# EAGLE design LCD board (EAGLE 9.1.3)
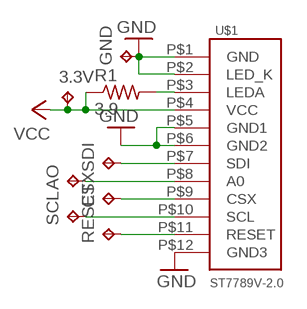
[diagram p0: schematic, sheet 1]

## Parts
3.3V  TPTP18RECT  [TP18RECT]
AO  TPTP18RECT  [TP18RECT]
CSX  TPTP18RECT  [TP18RECT]
GND  TPTP18RECT  [TP18RECT]
R1  3.9  R-US_R0603  [R0603]
RESET  TPTP18RECT  [TP18RECT]
SCL  TPTP18RECT  [TP18RECT]
SDI  TPTP18RECT  [TP18RECT]
U$1  ST7789V-2.0  [ST7789V-2.0]

## Nets
GND: GND.TP U$1.P$1(GND) U$1.P$2(LED_K) U$1.P$5(GND1) U$1.P$6(GND2) U$1.P$12(GND3)
N$1: R1.2 U$1.P$3(LEDA)
N$2: SDI.TP U$1.P$7(SDI)
N$3: AO.TP U$1.P$8(A0)
N$4: CSX.TP U$1.P$9(CSX)
N$5: SCL.TP U$1.P$10(SCL)
N$6: RESET.TP U$1.P$11(RESET)
VCC: 3.3V.TP R1.1 U$1.P$4(VCC)

## Library data of the parts
3.3V AO CSX GND RESET SCL SDI = testpad-old:TP: Test pad
R1 = resistor:R-US_: RESISTOR, American symbol
U$1 = ili9341:ST7789V-2.0

## Board
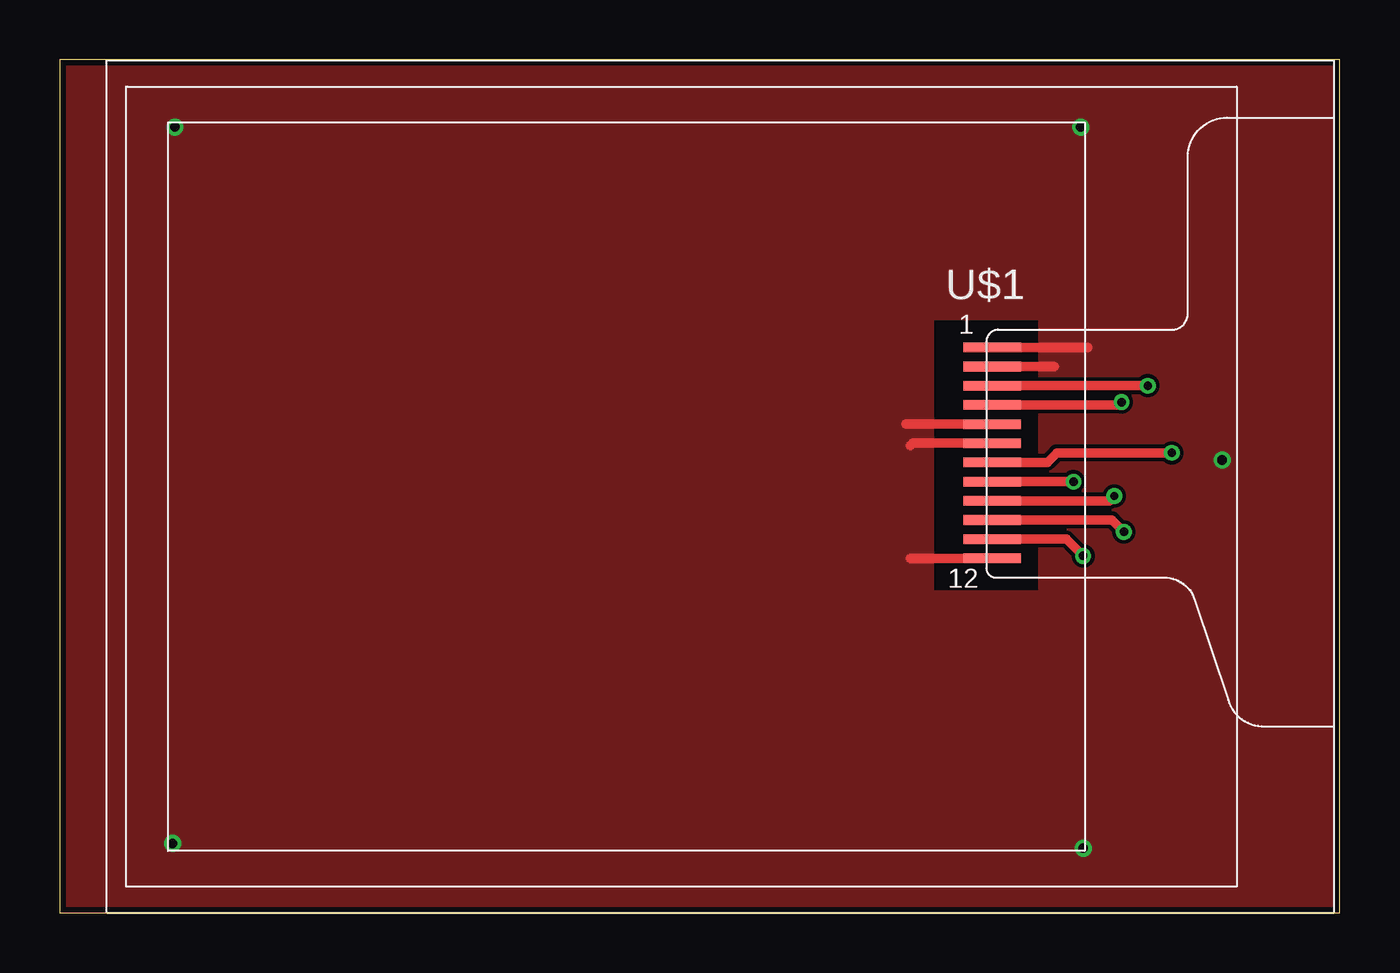
[diagram p1: board, top side]
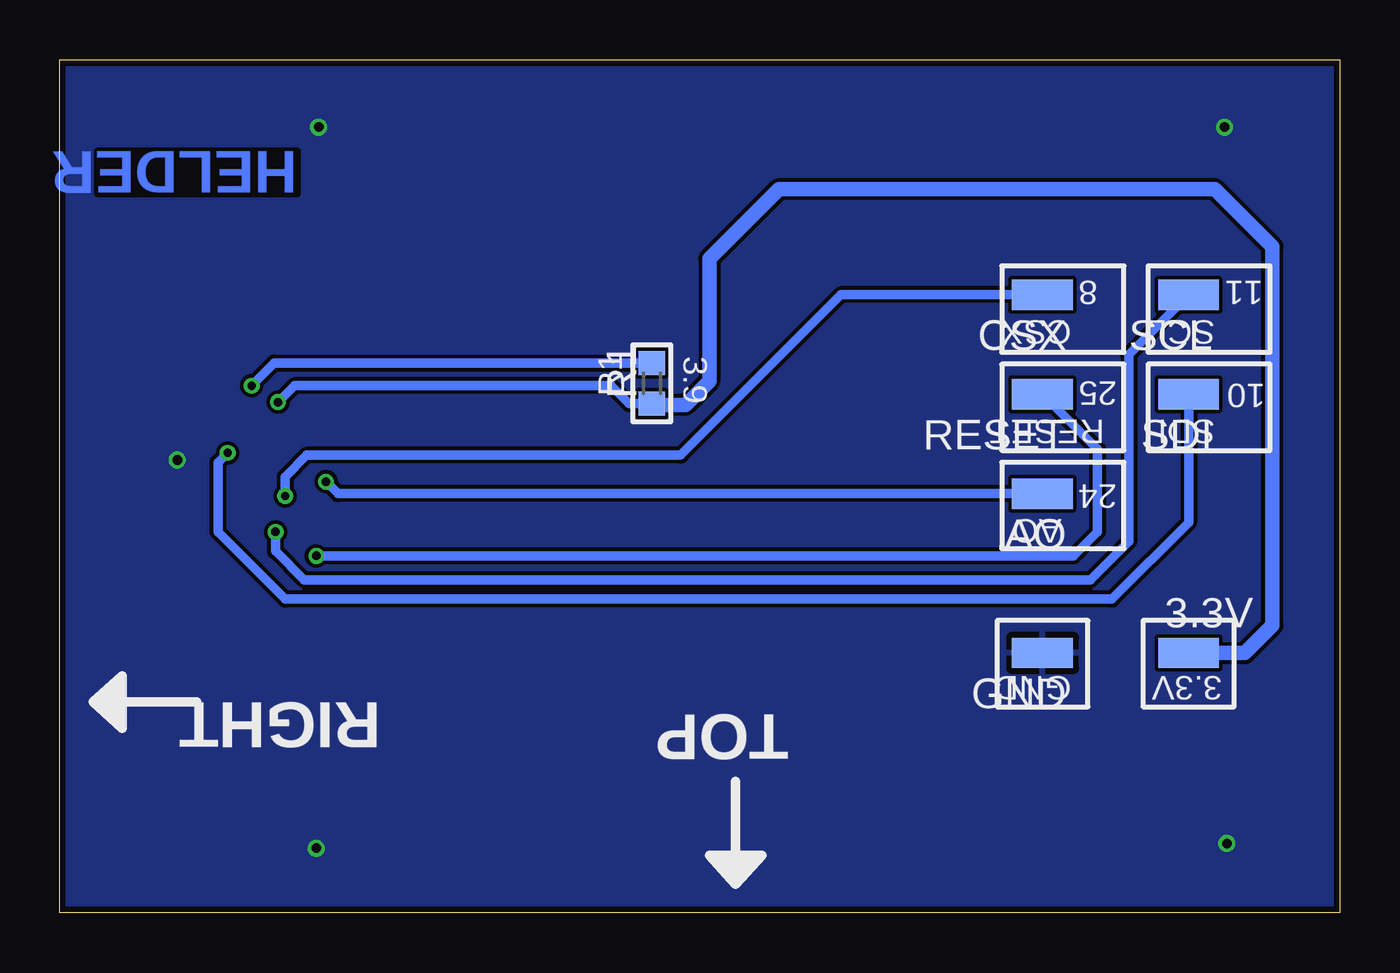
[diagram p2: board, bottom side, seen from below]

Size 53.4 x 35.6 mm. Coordinates in mm from the lower left corner, seen from the top.
Outline: 0,0 53.4,0 53.4,35.6 0,35.6 0,0
Copper layers (1*16): Top 0.035mm / dielectric 1.5mm / Bottom 0.035mm
Design rules "SeeedStudio_2layer": minimum track width 6mil, minimum drill 12mil, track to track 6mil, track to pad 6mil, pad to pad 6mil, via to via 6mil, smd to smd 0mil, copper to edge 10mil, drill to drill 10mil, minimum pad ring 10mil, minimum via ring 6mil, stop-mask expansion 2mil, vias tented up to drill 100mil, thermal gap 10mil

### Footprints (pad centres in the part's own frame; a part is rotated, then mirrored left to right if it is on the bottom)
TP18RECT = smd 2.54 x 1.27: TP 0,0
R0603 = smd 1 x 1.1: 1 -0.85,0; 2 0.85,0
ST7789V-2.0 = smd 2.4 x 0.4: P$1 16.44,4.51; P$2 16.44,3.71; P$3 16.44,2.91; P$4 16.44,2.11; P$5 16.44,1.31; P$6 16.44,0.51; P$7 16.44,-0.29; P$8 16.44,-1.09; P$9 16.44,-1.89; P$10 16.44,-2.69; P$11 16.44,-3.49; P$12 16.44,-4.29

### Placement (x,y rotation side)
3.3V  6.3,10.85 0 bottom
AO  12.4,17.5 180 bottom
CSX  12.4,25.8 180 bottom
GND  12.4,10.85 180 bottom
R1  28.7,22.1 90 bottom
RESET  12.4,21.65 180 bottom
SCL  6.3,25.8 180 bottom
SDI  6.3,21.65 180 bottom
U$1  22.46,19.09 0 top

### Tracks (layer width: path | path; a pad name or v marks a point on that pad's centre or on a via)
GND  (via drill 0.4)
  Top 0.406: U$1.P$2 41.5,22.8 | U$1.P$5 35.3,20.4 | U$1.P$12 35.5,14.8 | U$1.P$1 42.9,23.6 | U$1.P$6 35.6,19.6 35.5,19.5
  other vias: 42.6,32.8 42.7,2.7 4.7,2.9 4.8,32.8 48.5,18.9
  pour Top: -0.1,35.8 53.4,35.8 53.4,24.8 36.4,24.8 36.4,13.4 53.4,13.4 53.4,-0.2 -0.1,-0.2 -0.1,35.7 -0.1,35.8
  pour Top: 40.9,13.4 40.9,24.8 53.4,24.8 53.4,13.4
  pour Bottom: 53.4,35.8 53.4,24.8 53.4,13.4 53.4,-0.2 -0.1,-0.2 -52.8,40.6 0,35.8
N$1  (via drill 0.35)
  Top 0.406: U$1.P$3 v45.4,22
  Bottom 0.406: v45.4,22 44.45,22.95 R1.2
N$2  (via drill 0.35)
  Top 0.406: v46.4,19.2 41.6,19.2 41.2,18.8 U$1.P$7
  Bottom 0.406: SDI.TP 6.3,16.3 9.5,13.1 44,13.1 46.8,15.9 46.8,18.8 v46.4,19.2
N$3  (via drill 0.35)
  Top 0.406: v42.3,18 U$1.P$8
  Bottom 0.406: AO.TP 41.8,17.5 v42.3,18
N$4  (via drill 0.35)
  Top 0.406: v44,17.4 43.8,17.2 41.7,17.2 U$1.P$9
  Bottom 0.406: CSX.TP 20.8,25.8 27.5,19.1 43.1,19.1 44,18.2 v44,17.4
N$5  (via drill 0.35)
  Top 0.406: v44.4,15.9 43.9,16.4 U$1.P$10
  Bottom 0.406: SCL.TP 8.8,23.3 8.8,15.5 10.4,13.9 43.2,13.9 44.4,15.1 v44.4,15.9
N$6  (via drill 0.35)
  Top 0.406: v42.7,14.9 42,15.6 U$1.P$11
  Bottom 0.406: RESET.TP 10.1,19.35 10.1,15.9 11.1,14.9 v42.7,14.9
VCC  (via drill 0.35)
  Top 0.406: v44.3,21.32 44.18,21.2 U$1.P$4
  Bottom 0.406: R1.1 29.65,21.25 30.4,22 43.6,22 44.2,21.4 44.22,21.4 v44.3,21.32
  Bottom 0.61: 3.3V.TP 3.95,10.85 2.8,12 2.8,27.8 5.2,30.2 23.4,30.2 26.3,27.3 26.3,22.2 27.3,21.2 28.65,21.2 R1.1

### Text on the board
Bottom: HELDER
_tsilk: 1 | ST7789V-2.0 | 12
_bsilk: 11 | 8 | SCL | CSX | 3.9 | 10 | 25 | R1 | SDI | RESET | 24 | AO | 3.3V | GND | RIGHT | TOP